# Altium schematic sheet S9013LT1_2021-11-22.schdoc
size 39 x 37 mm
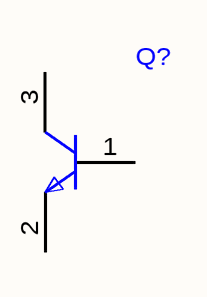
[diagram p0: S9013LT1_2021-11-22.schdoc]

## Parts
Q?  (no value)  [SOT-23]

## Nets

Not connected (* = marked no-connect by the designer): Q? 1(B) 2(E) 3(C)

## Library data of the parts
Q? = S9013LT1